# EAGLE design LSM330DLC (EAGLE 7.1.0)
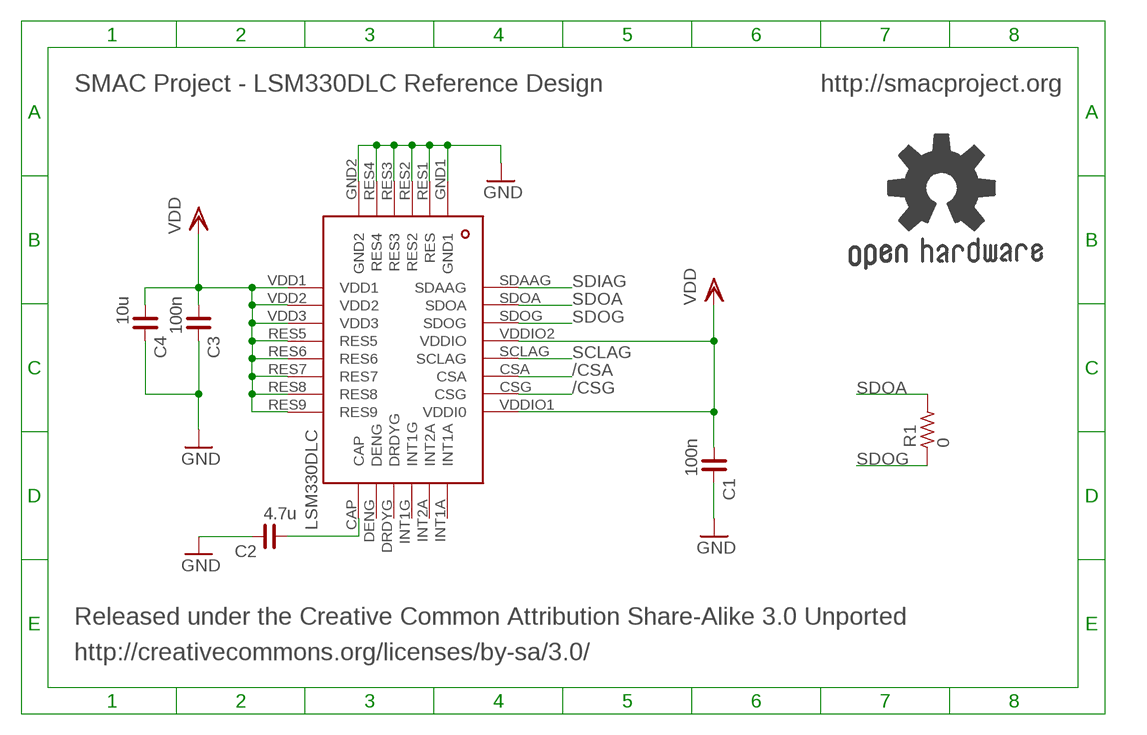
[diagram p0: schematic, sheet 1]

## Parts
C1  100n  C_0402  [C0402]
C2  4.7u  C_0402  [C0402]
C3  100n  C_0402  [C0402]
C4  10u  C_0402  [C0402]
GOLD_ORB_SM2  OSHWLOGO_REF_SM  [OSHW2REF]
IC1  LSM330DLC  [LSM330DLC]
R1  0  R_0402  [R0402]

## Nets
/CSA: IC1.CSA
/CSG: IC1.CSG
GND: C1.2 C2.2 C3.2 C4.2 IC1.GND1 IC1.GND2 IC1.RES1(RES) IC1.RES2 IC1.RES3 IC1.RES4
N$5: C2.1 IC1.CAP
SCLAG: IC1.SCLAG
SDIAG: IC1.SDAAG
SDOA: IC1.SDOA R1.2
SDOG: IC1.SDOG R1.1
VDD: C1.1 C3.1 C4.1 IC1.RES5 IC1.RES6 IC1.RES7 IC1.RES8 IC1.RES9 IC1.VDD1 IC1.VDD2 IC1.VDD3 IC1.VDDIO1(VDDI0) IC1.VDDIO2(VDDIO)
Unconnected: IC1.DENG IC1.DRDYG IC1.INT1A IC1.INT1G IC1.INT2A

## Notes on the sheet
- SMAC Project - LSM330DLC Reference Design | http://smacproject.org
- Released under the Creative Common Attribution Share-Alike 3.0 Unported
- http://creativecommons.org/licenses/by-sa/3.0/

## Library data of the parts
C1-C4 = rc-master-smd:C_: NON-POLARIZED CAP
GOLD_ORB_SM2 = bfl:OSHWLOGO: These are Open-Source Hardware logos.
IC1 = LSM330DLC:LSM330DLC
R1 = rc-master-smd:R_: RESISTOR

## Board
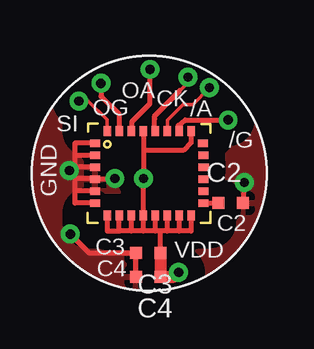
[diagram p1: board, top side]
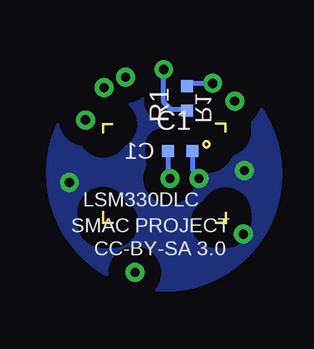
[diagram p2: board, bottom side, seen from below]

Size 5.13 x 4.13 mm. Coordinates in mm from the lower left corner, seen from the top.
Copper layers (1*16): Top 0.035mm / dielectric 1.5mm / Bottom 0.035mm
Design rules "default": minimum track width 10mil, minimum drill 0.6mm, track to track 8mil, track to pad 8mil, pad to pad 8mil, via to via 8mil, smd to smd 8mil, copper to edge 40mil, drill to drill 8mil, minimum pad ring 10mil, minimum via ring 8mil, stop-mask expansion 4mil, vias tented up to drill 0mil, thermal gap 10mil

### Footprints (pad centres in the part's own frame; a part is rotated, then mirrored left to right if it is on the bottom)
C0402 = smd 0.5 x 0.5: 1 -0.508,0; 2 0.508,0
LSM330DLC = smd 0.425 x 0.325: CAP 2.263,-1.25; DENG 2.263,-0.75; DRDYG 2.263,-0.25; GND1 -2.263,1.25; GND2 -2.263,-1.25; INT1A 2.237,1.25; INT1G 2.268,0.25; INT2A 2.263,0.75; RES1 -2.263,0.75; RES2 -2.263,0.25; RES3 -2.263,-0.25; RES4 -2.263,-0.75 | smd 0.325 x 0.425: CSA 0.75,1.762; CSG 1.25,1.762; RES5 -0.25,-1.762; RES6 0.25,-1.762; RES7 0.75,-1.762; RES8 1.25,-1.762; RES9 1.75,-1.762; SCLAG 0.25,1.762; SDAAG -1.75,1.762; SDOA -1.25,1.762; SDOG -0.75,1.762; VDD1 -1.75,-1.762; VDD2 -1.25,-1.762; VDD3 -0.75,-1.762; VDDIO1 1.75,1.762; VDDIO2 -0.25,1.762
R0402 = smd 0.5 x 0.5: 1 -0.508,0; 2 0.508,0

### Placement (x,y rotation side)
C1  1.9,2.99 0 bottom
C2  5.97,0.82 0 top
C3  2.54,-1.25 180 top
C4  2.53,-2.25 180 top
GOLD_ORB_SM2  9.23,-1.39 0 top  (outside the outline)
IC1  2.57,2.07 0 top
R1  1.63,5.19 90 bottom

### Tracks (layer width: path | path; a pad name or v marks a point on that pad's centre or on a via)
/CSA  (via drill 0.38 pad 0.76)
  Top 0.15: IC1.CSA 3.33,4.28 3.98,4.93 4.38,4.93 v5.08,5.64
  Top 0.2: IC1.CSA
/CSG  (via drill 0.38 pad 0.76)
  Top 0.2: IC1.CSG 3.84,3.83 3.79,4.07 4.06,4.29 v5.86,4.29
GND  (via drill 0.38 pad 0.76)
  Top 0.2: IC1.GND1 -0.54,3.32 -0.54,2.94 -0.54,2.82 | -0.54,2.82 IC1.RES1 | -0.53,1.85 0.31,1.85 IC1.RES3 v1.13,1.85 | -0.53,1.85 -0.53,2.38 | -0.53,2.38 -0.53,2.82 -0.54,2.82 | IC1.RES2 -0.48,2.32 arc-90 -0.53,2.38 | IC1.RES4 -0.53,1.32 | -0.53,1.32 -0.53,1.85 | IC1.GND2 -0.53,0.82 -0.53,1.32 | C2.2 6.51,0.82 v6.53,1.68 | C4.2 C3.2 2,-1.28 0.08,-1.28 v-0.73,-0.47
  Bottom 0.2: C1.2 1.39,2.2 v1.13,1.85
  other vias: -0.77,2.17
  pour Bottom (isolate 0.7): -2.29,2.04 -2.29,2.04 arc-90 2.59,6.92 2.62,6.92 arc-90 7.43,2.11 7.43,2.07 arc-90 2.54,-2.82 arc-91 -2.29,2.06
  pour Top (isolate 0.7): -2.29,2.05 -2.29,2.05 arc-90 2.59,6.92 2.62,6.92 arc-90 7.43,2.12 7.43,2.07 arc-90 2.54,-2.81 arc-91 -2.29,2.06
N$5
  Top 0.2: IC1.CAP C2.1
SCLAG  (via drill 0.38 pad 0.76)
  Top 0.15: 3.85,5.52 4.12,5.79 v4.19,6.08
  Top 0.2: IC1.SCLAG 2.79,3.86 2.79,4.35 2.79,4.46 3.85,5.52
SDIAG  (via drill 0.38 pad 0.76)
  Top 0.15: IC1.SDAAG 0.8,3.85 0.8,4.31 0.03,5.08 v-0.37,5.08
SDOA  (via drill 0.38 pad 0.76)
  Top 0.2: IC1.SDOA 1.32,4.51 0.66,5.17 0.55,5.28 v0.55,5.82
  Bottom 0.2: R1.2 1.51,5.82 v0.55,5.82
SDOG  (via drill 0.38 pad 0.76)
  Top 0.2: IC1.SDOG 1.84,3.86 1.84,4.21 2.59,4.96 v2.59,6.4
  Bottom 0.2: R1.1 1.67,4.73 2.28,4.73 2.59,5.04 v2.59,6.4
VDD  (via drill 0.38 pad 0.76)
  Top 0.2: 2.34,3.83 IC1.VDDIO2 2.34,3.83 | IC1.VDDIO1 4.32,3.34 3.99,3.02 2.33,3.02 v2.33,1.86 | 2.34,3.83 2.34,3.02 v2.33,1.86 | IC1.VDD1 0.81,-0.34 1.32,-0.34 | 1.32,-0.34 IC1.VDD2 | IC1.VDD3 1.82,-0.34 | 1.82,-0.34 1.32,-0.34 | 2.32,-0.34 IC1.RES5 2.33,0.31 v2.33,1.86 | 2.32,-0.34 1.82,-0.34 | IC1.RES6 2.82,-0.34 | 2.82,-0.34 2.32,-0.34 | IC1.RES7 3.32,-0.34 | 3.32,-0.34 3.08,-0.34 | 3.08,-0.34 2.82,-0.34 | IC1.RES8 3.82,-0.34 | 3.82,-0.34 3.32,-0.34 | IC1.RES9 4.32,-0.34 3.82,-0.34 | C3.1 3.04,-0.38 3.08,-0.34
  Top 0.5: C3.1 C4.1 3.6,-2.25 v3.8,-2.07
  Bottom 0.2: C1.1 2.41,1.93 v2.33,1.86

### Text on the board
tPlace: OA | CK | SI | OG | /A | /G | GND | C2 | C3 | C4 | VDD
bPlace: R1 | C1 | LSM330DLC | SMAC PROJECT | CC-BY-SA 3.0
Reference: http://smacproject.org